# Altium schematic sheet [03] - SCHEMATIC.SchDoc
size Letter; Organization: Altium Limited; Address1: L3, 12a Rodborough Rd; Address2: Frenchs Forest; Address3: NSW; Address4: Australia 2086; SheetNumber: 3; SheetTotal: 5
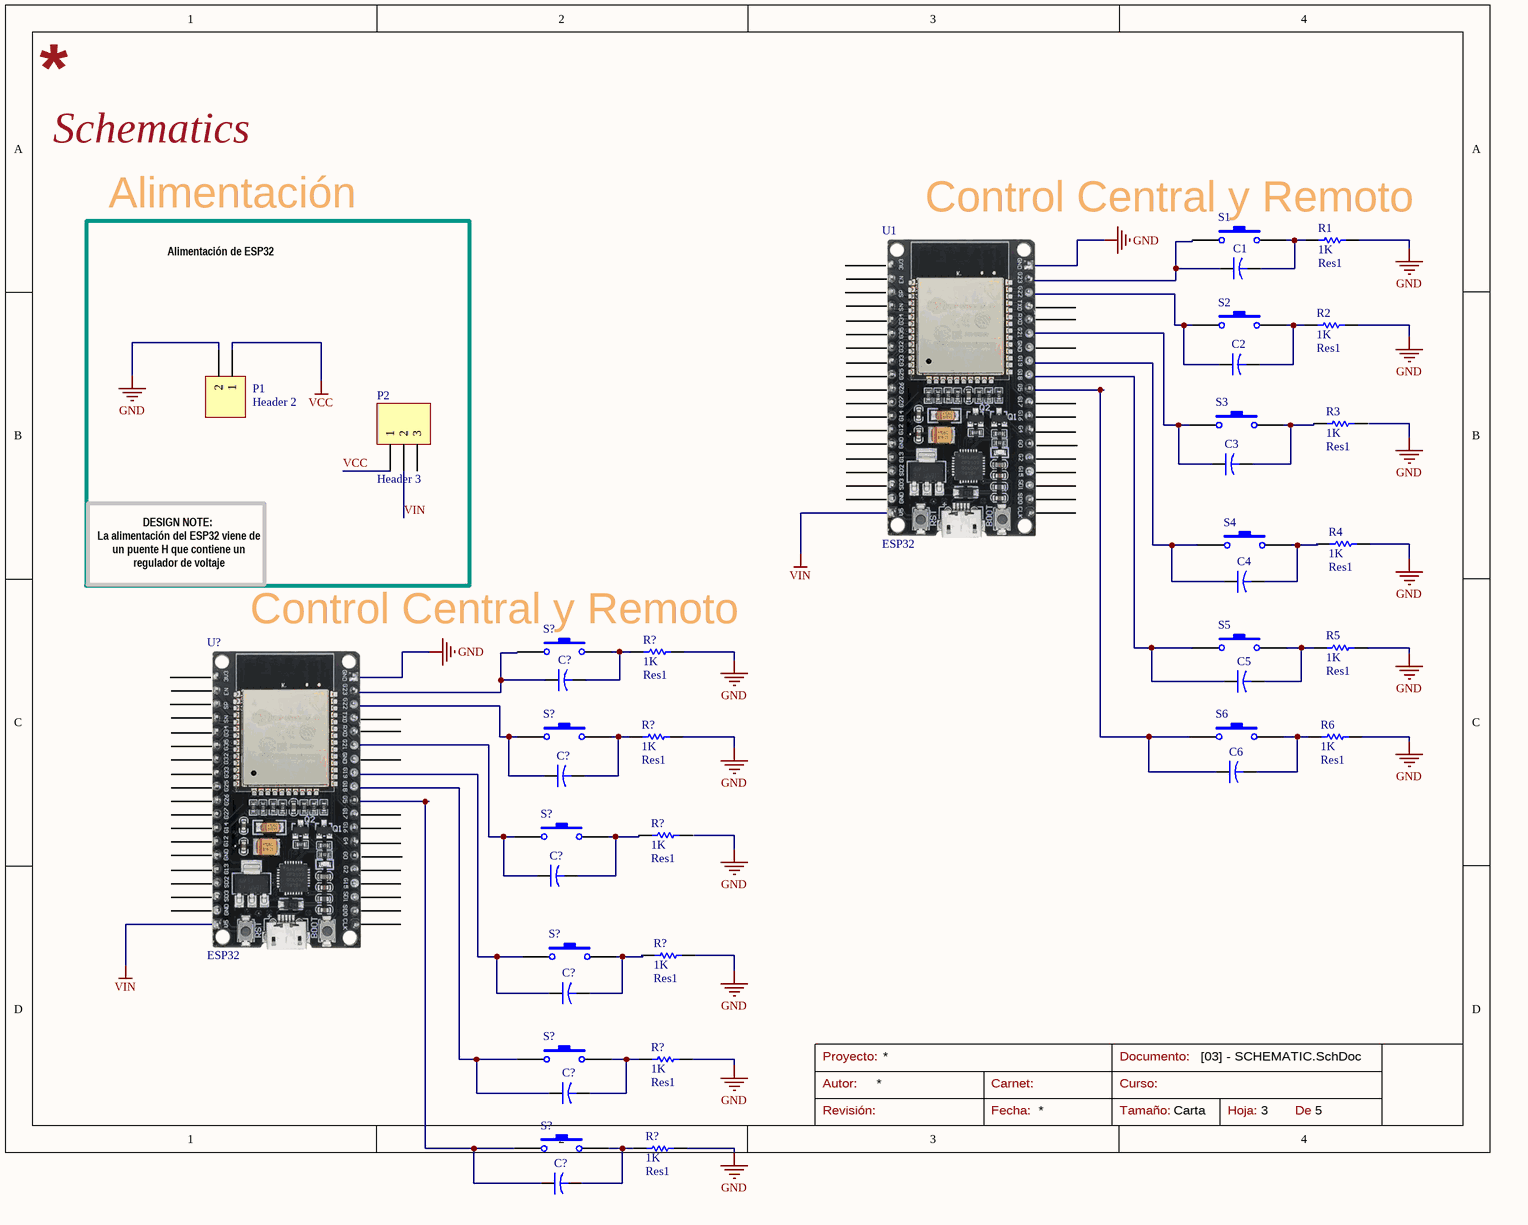
[diagram p0: [03] - SCHEMATIC.SchDoc]

## Parts
(Parts that share a designator on the sheet are numbered #1, #2 ... from top to bottom, then left to right.)
C1  Cap2  [CAPR5-4X5]  (value not drawn)
C2  Cap2  [CAPR5-4X5]  (value not drawn)
C3  Cap2  [CAPR5-4X5]  (value not drawn)
C4  Cap2  [CAPR5-4X5]  (value not drawn)
C5  Cap2  [CAPR5-4X5]  (value not drawn)
C6  Cap2  [CAPR5-4X5]  (value not drawn)
C?#1  Cap2  [CAPR5-4X5]  (value not drawn)
C?#2  Cap2  [CAPR5-4X5]  (value not drawn)
C?#3  Cap2  [CAPR5-4X5]  (value not drawn)
C?#4  Cap2  [CAPR5-4X5]  (value not drawn)
C?#5  Cap2  [CAPR5-4X5]  (value not drawn)
C?#6  Cap2  [CAPR5-4X5]  (value not drawn)
P1  Header 2  [HDR1X2]
P2  Header 3  [HDR1X3]
R1  Res1  value 1K  [AXIAL-0.3]
R2  Res1  value 1K  [AXIAL-0.3]
R3  Res1  value 1K  [AXIAL-0.3]
R4  Res1  value 1K  [AXIAL-0.3]
R5  Res1  value 1K  [AXIAL-0.3]
R6  Res1  value 1K  [AXIAL-0.3]
R?#1  Res1  value 1K  [AXIAL-0.3]
R?#2  Res1  value 1K  [AXIAL-0.3]
R?#3  Res1  value 1K  [AXIAL-0.3]
R?#4  Res1  value 1K  [AXIAL-0.3]
R?#5  Res1  value 1K  [AXIAL-0.3]
R?#6  Res1  value 1K  [AXIAL-0.3]
S1  SW-PB  [SPST-2]  (value not drawn)
S2  SW-PB  [SPST-2]  (value not drawn)
S3  SW-PB  [SPST-2]  (value not drawn)
S4  SW-PB  [SPST-2]  (value not drawn)
S5  SW-PB  [SPST-2]  (value not drawn)
S6  SW-PB  [SPST-2]  (value not drawn)
S?#1  SW-PB  [SPST-2]  (value not drawn)
S?#2  SW-PB  [SPST-2]  (value not drawn)
S?#3  SW-PB  [SPST-2]  (value not drawn)
S?#4  SW-PB  [SPST-2]  (value not drawn)
S?#5  SW-PB  [SPST-2]  (value not drawn)
S?#6  SW-PB  [SPST-2]  (value not drawn)
U1  ESP32  [ESP32]
U?  ESP32  [ESP32]

## Blocks framed on the sheet
Alimentación: P1 P2

## Nets
GND: P1.2 R1.2 R2.2 R4.2 R5.2 R6.2 R?#1.2 R?#2.2 R?#4.2 R?#5.2 R?#6.2 U1.38(GND) U?.38(GND)
VCC: P1.1 P2.1
VIN: P2.2 U1.19(V5) U?.19(V5)
NetC1_1: C1.1 S1.1 U1.37(G23)
NetC1_2: C1.2 R1.1 S1.2
NetC2_1: C2.1 S2.1 U1.36(G22)
NetC2_2: C2.2 R2.1 S2.2
NetC3_1: C3.1 S3.1 U1.33(G21)
NetC3_2: C3.2 R3.1 S3.2
NetC4_1: C4.1 S4.1 U1.31(G19)
NetC4_2: C4.2 R4.1 S4.2
NetC5_1: C5.1 S5.1 U1.30(G18)
NetC5_2: C5.2 R5.1 S5.2
NetC6_1: C6.1 S6.1 U1.29(G5)
NetC6_2: C6.2 R6.1 S6.2
NetC?#1_1: C?#1.1 S?#1.1 U?.37(G23)
NetC?#1_2: C?#1.2 R?#1.1 S?#1.2
NetC?#2_1: C?#2.1 S?#2.1 U?.36(G22)
NetC?#2_2: C?#2.2 R?#2.1 S?#2.2
NetC?#3_1: C?#3.1 S?#3.1 U?.33(G21)
NetC?#3_2: C?#3.2 R?#3.1 S?#3.2
NetC?#4_1: C?#4.1 S?#4.1 U?.31(G19)
NetC?#4_2: C?#4.2 R?#4.1 S?#4.2
NetC?#5_1: C?#5.1 S?#5.1 U?.30(G18)
NetC?#5_2: C?#5.2 R?#5.1 S?#5.2
NetC?#6_1: C?#6.1 S?#6.1 U?.29(G5)
NetC?#6_2: C?#6.2 R?#6.1 S?#6.2

Not connected (* = marked no-connect by the designer): P2 3; R3 2; R?#3 2; U1 1(3V3) 2(EN) 3(SP) 4(SN) 5(G34) 6(G35) 7(G32) 8(G33) 9(G25) 10(G26) 11(G27) 12(G14) 13(G12) 14(GND) 15(G13) 16(SD2) 17(SD3) 18(CMD) 20(CLK) 21(SD0) 22(SD1) 23(G15) 24(G2) 25(G0) 26(G4) 27(G16) 28(G17) 32(GND) 34(RXD) 35(TXD); U? 1(3V3) 2(EN) 3(SP) 4(SN) 5(G34) 6(G35) 7(G32) 8(G33) 9(G25) 10(G26) 11(G27) 12(G14) 13(G12) 14(GND) 15(G13) 16(SD2) 17(SD3) 18(CMD) 20(CLK) 21(SD0) 22(SD1) 23(G15) 24(G2) 25(G0) 26(G4) 27(G16) 28(G17) 32(GND) 34(RXD) 35(TXD)

## Notes on the sheet
- Schematics
- Control Central y Remoto
- Alimentación de ESP32
- DESIGN NOTE:
  La alimentación del ESP32 viene de un puente H que contiene un regulador de voltaje
- Proyecto:
- Autor:
- Carnet:
- Documento:
- Curso:
- Revisión:
- Fecha:
- Tamaño:
- Carta
- Hoja:
- De

## Library data of the parts
C1-C6 C?#1-C?#6 = Cap2: Capacitor; Value: 100pF; Published: 23-Sep-2002; PackageReference: CAPR5-4X5; Publisher: Altium Limited; PackageDescription: Capacitor; 2 Leads
P1 = Header 2: Header, 2-Pin; LatestRevisionDate: 17-Jul-2002; LatestRevisionNote: Re-released for DXP Platform.; Publisher: Altium Limited
P2 = Header 3: Header, 3-Pin; LatestRevisionDate: 17-Jul-2002; LatestRevisionNote: Re-released for DXP Platform.; Publisher: Altium Limited
R1-R6 R?#1-R?#6 = Res1: Resistor; Published: 8-Jun-2000; LatestRevisionDate: 17-Jul-2002; LatestRevisionNote: Re-released for DXP Platform.; PackageReference: AXIAL-0.3; Publisher: Altium Limited; PackageDescription: Axial Device, Thru-Hole; 2 Leads; 0.3 in Pin Spacing
S1-S6 S?#1-S?#6 = SW-PB: Switch; Published: 24-Mar-1999; LatestRevisionDate: 17-Jul-2002; LatestRevisionNote: Re-released for DXP Platform.; PackageReference: SPST-2; Publisher: Altium Limited; PackageDescription: Switch; 2 Leads
U1 U? = ESP32: ESP32-S2-WROVER Series Evaluation Board 4MB Flash 802.11 b/g/n (WiFi, WLAN); Manufacturer: Espressif Systems; Manufacturer Part Number: ESP32-S2-SAOLA-1R; Frequency: 2.4GHz; Supplier: Digikey; Supplier Part Number: 1965-ESP32-S2-SAOLA-1R-ND; RoHS: No; Category: RF Semiconductors and Devices; Pricing: 588=8.03772 (USD); Series: ESP32; ComponentLink1URL: https://www.espressif.com/sites/default/files/documentation/espressif_products_ordering_information_en.pdf?src-supplier=Digikey; ComponentLink1Description: https://www.espressif.com/sites/default/files/documentation/espressif_products_ordering_information_en.pdf?src-supplier=Digikey; ComponentLink2URL: https://datasheet.octopart.com/ESP32-S2-SAOLA-1R-Espressif-Systems-datasheet-154571409.pdf?src-supplier=Jameco; ComponentLink2Description: https://datasheet.octopart.com/ESP32-S2-SAOLA-1R-Espressif-Systems-datasheet-154571409.pdf?src-supplier=Jameco; ComponentLink3URL: https://datasheet.octopart.com/ESP32-S2-SAOLA-1R-Espressif-Systems-datasheet-165560559.pdf?src-supplier=TME; ComponentLink3Description: https://datasheet.octopart.com/ESP32-S2-SAOLA-1R-Espressif-Systems-datasheet-165560559.pdf?src-supplier=TME